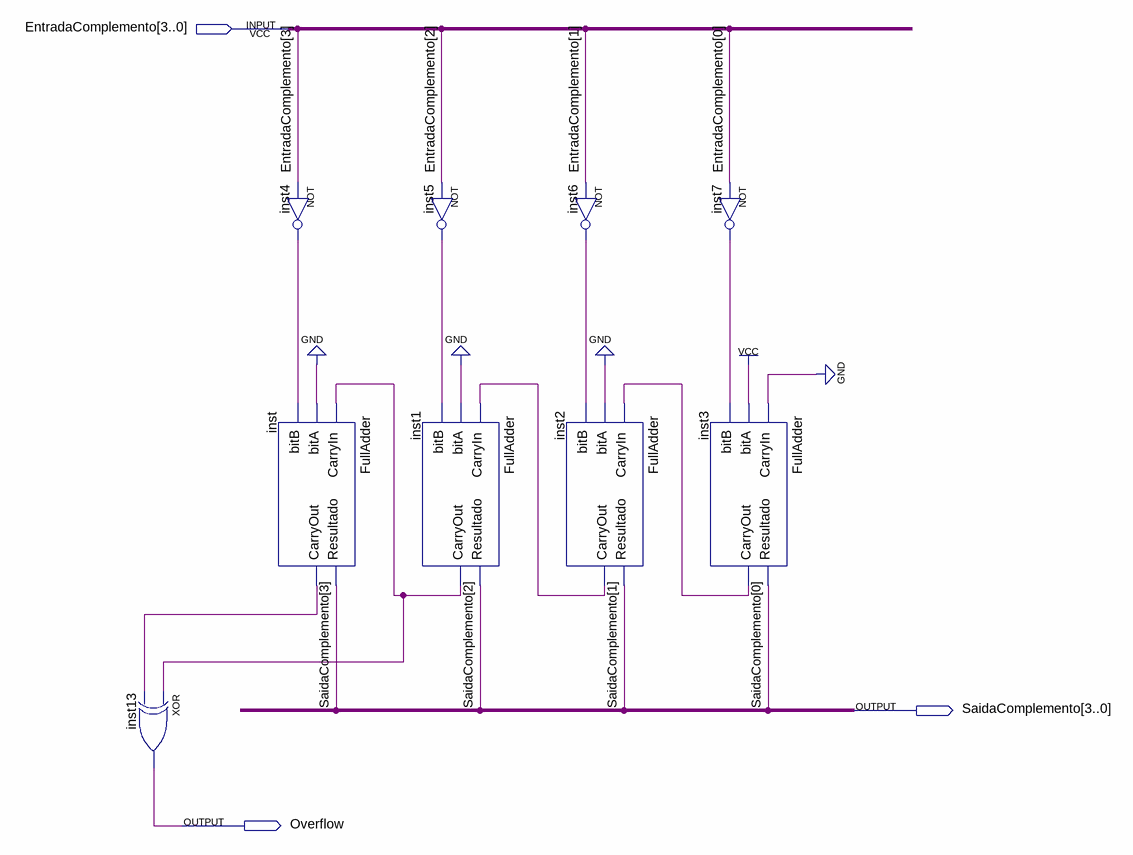
[diagram p0: schematic sheet]
// Quartus schematic Complemento.bdf as structural Verilog: 9 symbols, 3 pins
module Complemento (
  input  [3:0] EntradaComplemento,
  output [3:0] SaidaComplemento,
  output Overflow
);

  wire inst1_carryout, inst2_carryout, inst3_carryout, inst4_out, inst5_out, inst6_out, inst7_out,
       inst_carryout;

  xor inst13 (Overflow, inst1_carryout, inst_carryout);
  not inst4 (inst4_out, EntradaComplemento[3]);
  FullAdder inst (
    .CarryIn(inst1_carryout), .bitA(1'b0), .bitB(inst4_out), .Resultado(SaidaComplemento[3]),
    .CarryOut(inst_carryout));
  FullAdder inst1 (
    .CarryIn(inst2_carryout), .bitA(1'b0), .bitB(inst5_out), .Resultado(SaidaComplemento[2]),
    .CarryOut(inst1_carryout));
  not inst5 (inst5_out, EntradaComplemento[2]);
  FullAdder inst2 (
    .CarryIn(inst3_carryout), .bitA(1'b0), .bitB(inst6_out), .Resultado(SaidaComplemento[1]),
    .CarryOut(inst2_carryout));
  not inst6 (inst6_out, EntradaComplemento[1]);
  not inst7 (inst7_out, EntradaComplemento[0]);
  FullAdder inst3 (
    .CarryIn(1'b0), .bitA(1'b1), .bitB(inst7_out), .Resultado(SaidaComplemento[0]), .CarryOut(inst3_carryout));
endmodule
